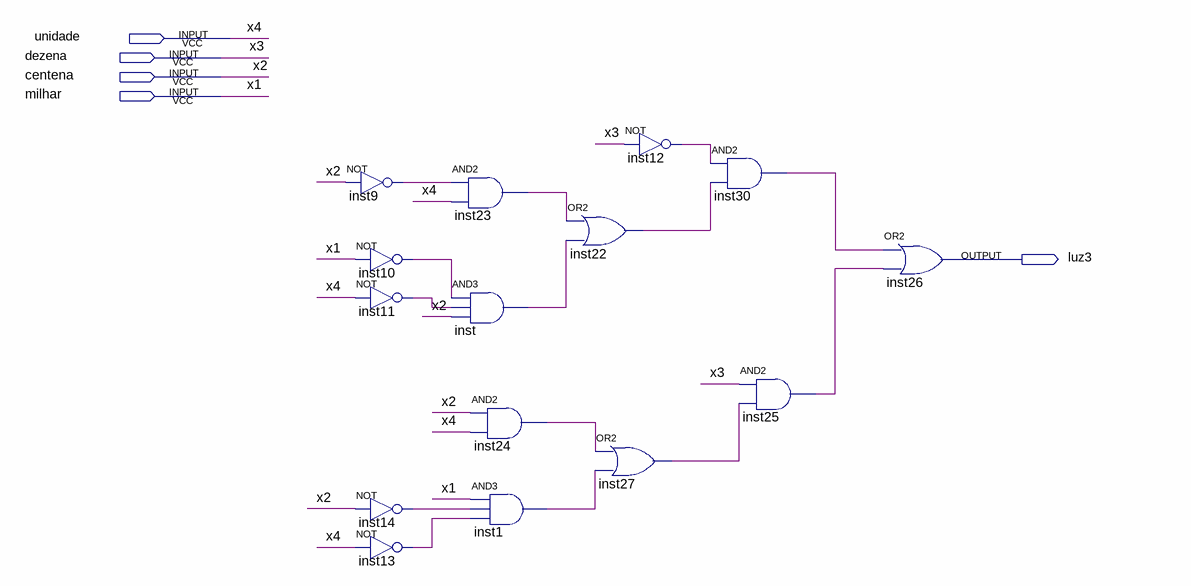
[diagram p0: schematic sheet]
// Quartus schematic luz3.bdf as structural Verilog: 15 symbols, 5 pins
module luz3 (
  input  unidade,
  input  dezena,
  input  centena,
  input  milhar,
  output luz3
);

  wire inst1_out, inst9_out, inst10_out, inst11_out, inst12_out, inst13_out, inst14_out, inst22_out,
       inst23_out, inst24_out, inst25_out, inst27_out, inst30_out, inst_out;

  not inst9 (inst9_out, centena);
  not inst10 (inst10_out, milhar);
  not inst11 (inst11_out, unidade);
  not inst14 (inst14_out, centena);
  not inst13 (inst13_out, unidade);
  and inst23 (inst23_out, inst9_out, unidade);
  and inst (inst_out, inst10_out, inst11_out, centena);
  and inst24 (inst24_out, centena, unidade);
  and inst1 (inst1_out, milhar, inst14_out, inst13_out);
  not inst12 (inst12_out, dezena);
  or inst22 (inst22_out, inst23_out, inst_out);
  or inst27 (inst27_out, inst24_out, inst1_out);
  and inst30 (inst30_out, inst12_out, inst22_out);
  and inst25 (inst25_out, dezena, inst27_out);
  or inst26 (luz3, inst30_out, inst25_out);

  // Other names for the same wires on the sheet: x1 = milhar; x2 = centena; x3 = dezena; x4 = unidade
endmodule
